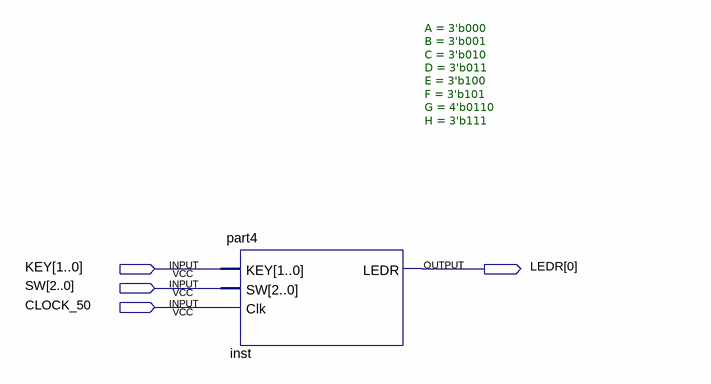
[diagram p0: schematic sheet]
// Quartus schematic Block12.bdf as structural Verilog: 1 symbols, 4 pins
module Block12 (
  input  [1:0] KEY,
  input  [2:0] SW,
  input  CLOCK_50,
  output [0:0] LEDR
);

  part4 #(.A(3'b000), .B(3'b001), .C(3'b010), .D(3'b011), .E(3'b100), .F(3'b101), .G(4'b0110), .H(3'b111)) inst (
    .KEY(KEY), .SW(SW), .Clk(CLOCK_50), .LEDR(LEDR[0]));
endmodule
